# Altium schematic sheet MAX669 out.SchDoc
size A4
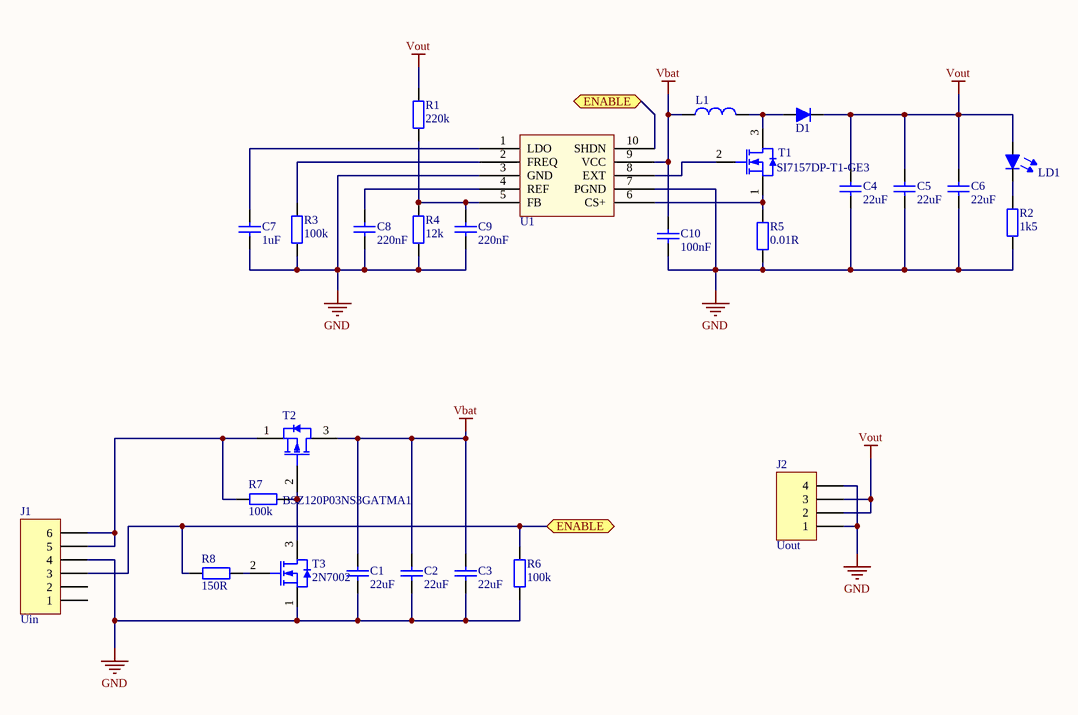
[diagram p0: MAX669 out.SchDoc]

## Parts
C1  value 22uF  [1210 CAP]  (hidden comment: Capacitor)
C2  value 22uF  [1210 CAP]  (hidden comment: Capacitor)
C3  value 22uF  [1210 CAP]  (hidden comment: Capacitor)
C4  value 22uF  [1210 CAP]  (hidden comment: Capacitor)
C5  value 22uF  [1210 CAP]  (hidden comment: Capacitor)
C6  value 22uF  [1210 CAP]  (hidden comment: Capacitor)
C7  value 1uF  [0603 cap]  (hidden comment: Capacitor)
C8  value 220nF  [0603 cap]  (hidden comment: Capacitor)
C9  value 220nF  [0603 cap]  (hidden comment: Capacitor)
C10  value 100nF  [0603 cap]  (hidden comment: Capacitor)
D1  Diode  [TDSON Diode]  (value not drawn)
J1  Uin  [HDR1X6]
J2  Uout  [HDR1X4]
L1  Inductor  [Inductor 7x7]  (value not drawn)
LD1  LED diode  [LED_0603]  (value not drawn)
R1  value 220k  [0603 RES]  (hidden comment: Resistor generic)
R2  value 1k5  [0603 RES]  (hidden comment: Resistor generic)
R3  value 100k  [0603 RES]  (hidden comment: Resistor generic)
R4  value 12k  [0603 RES]  (hidden comment: Resistor generic)
R5  value 0.01R  [2512 RES]  (hidden comment: Resistor generic)
R6  value 100k  [0603 RES]  (hidden comment: Resistor generic)
R7  value 100k  [0603 RES]  (hidden comment: Resistor generic)
R8  value 150R  [0603 RES]  (hidden comment: Resistor generic)
T1  value SI7157DP-T1-GE3  [TDSON-8]  (hidden comment: MOSFET-N)
T2  value BSZ120P03NS3GATMA1  [TDSON-8]  (hidden comment: MOSFET-P)
T3  value 2N7002  [SOT23]  (hidden comment: MOSFET-N)
U1  MAX669  [uMAX_10]  (value not drawn)

## Ports
ENABLE

## Nets
GND: C1.1 C2.1 C3.1 C4.1 C5.1 C6.1 C7.1 C8.1 C9.1 C10.1 J1.4 J2.1 J2.4 R2.1 R3.1 R4.1 R5.1 R6.1 T3.1(S) U1.3(GND) U1.7(PGND)
Vbat: C1.2 C2.2 C3.2 C10.2 L1.1 T2.3(S) U1.9(VCC)
Vout: C4.2 C5.2 C6.2 D1.2(K) J2.2 J2.3 LD1.1(A1) R1.2
ENABLE: J1.3 R6.2 R8.2 U1.10(SHDN) ; port ENABLE
NetC7_2: C7.2 U1.1(LDO)
NetC8_2: C8.2 U1.4(REF)
NetC9_2: C9.2 R1.1 R4.2 U1.5(FB)
NetD1_1: D1.1(A) L1.2 T1.3(D)
NetJ1_5: J1.5 J1.6 R7.2 T2.1(D)
NetLD1_2: LD1.2(K) R2.2
NetR3_2: R3.2 U1.2(FREQ)
NetR5_2: R5.2 T1.1(S) U1.6(CS+)
NetR7_1: R7.1 T2.2(G) T3.3(D)
NetR8_1: R8.1 T3.2(G)
NetT1_2: T1.2(G) U1.8(EXT)

Not connected (* = marked no-connect by the designer): J1 1 2

## Library data of the parts
C1-C3 = Capacitor NP: Voltage: 10V
C4-C6 = Capacitor NP: Voltage: 35V
C7-C10 = Capacitor NP: Voltage: >10V
D1 = Diode: NRVTS1245EMFST1G; Value: NRVTS1245EMFST1G
J1 = Header 6: Header, 6-Pin; LatestRevisionDate: 17-Jul-2002; LatestRevisionNote: Re-released for DXP Platform.; Publisher: Altium Limited
J2 = Header 4: Header, 4-Pin; LatestRevisionDate: 17-Jul-2002; LatestRevisionNote: Re-released for DXP Platform.; Publisher: Altium Limited
L1 = Inductor: Single coil; Value: 4.7uH; Current: >5A; Supplier 1: Farnell; Supplier Part Number 1: 2530091
LD1 = LED diode: LED; Value: Blue
R1-R8 = Resistor: Resistor SMD
T1 = MOSFET-N: MOSFET N; Voltage: *; Current: *
T2 = MOSFET-P: MOSFET P; Voltage: -30V; Current: -40A
T3 = MOSFET-N: MOSFET N; pin to pad: 1>2 2>1; Voltage: *; Current: *
U1 = MAX669: PWM Step-Up Controller; Value: MAX669